# Altium schematic sheet Smartfin Main PCBA_TOC.SchDoc: Table of Contents
size Letter; TOCFontName: Consolas; TOCFontSize: 24; TOCFontColor: 0; TOCFontAttributes: 0; TOCMaxLinesInTable: 25; TOCVerticalOffset: 200; TOCHorizontalOffset: 500; TOCHorizontalSeparation: 800; TOCVerticalSeparation: 30; TOCHorizTableSize: 640; Engineer: JOHN Q. ENGINEER; DocumentNumber: 000-000-000; Revision: A; SheetNumber: 1; SheetTotal: 8; PageSetup: Record=PageOptions|CenterHorizontal=True|CenterVertical=True|PrintScale=0.96|XCorrection=1.00|YCorrection=1.00|PrintKind=0|BorderSize=5000000|LeftOffset=0|BottomOffset=0|Orientation=2|PaperLength=1000|PaperWidth=1000|Scale=100|PaperSource=7|PrintQuality=-4|MediaType=1|DitherType=10|PaperKind=11" x 17"|PrintScaleMode=1
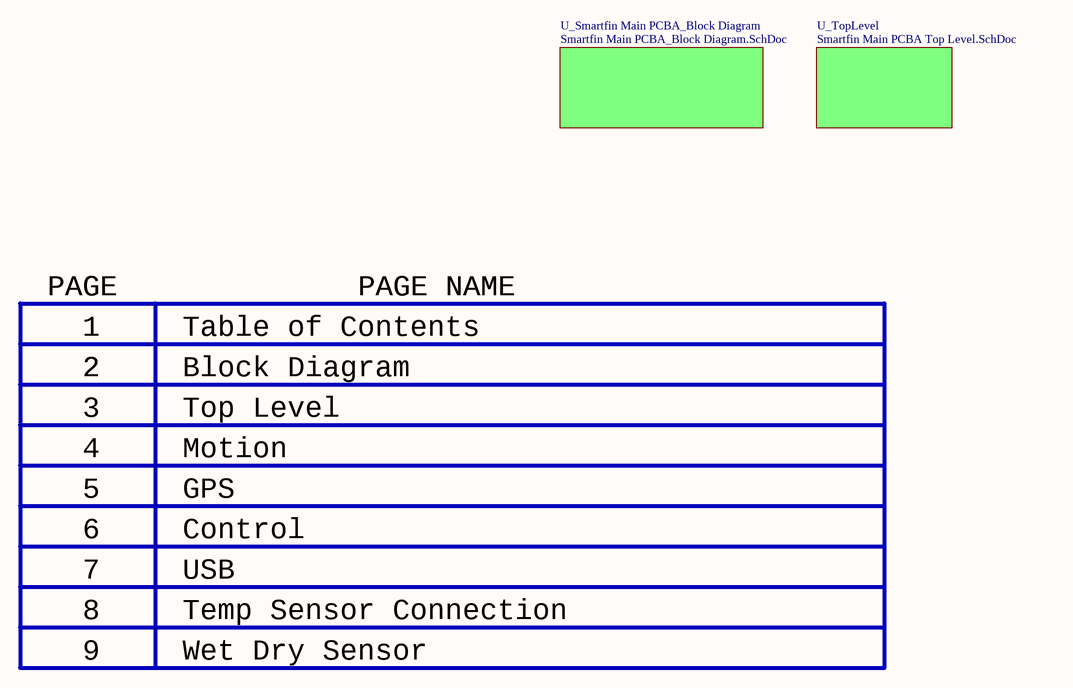
[diagram p0: Smartfin Main PCBA_TOC.SchDoc]

## Sub-sheets
U_Smartfin Main PCBA_Block Diagram = Smartfin Main PCBA_Block Diagram.SchDoc: no entries
U_TopLevel = Smartfin Main PCBA Top Level.SchDoc: no entries

## Notes on the sheet
- PAGE
- 1
- Table of Contents
- PAGE NAME
- 2
- Block Diagram
- 3
- 4
- Top Level
- Motion
- 5
- 6
- GPS
- Control
- 7
- USB
- 8
- 9
- Temp Sensor Connection
- Wet Dry Sensor